# Altium schematic sheet DIO.SchDoc
size A2
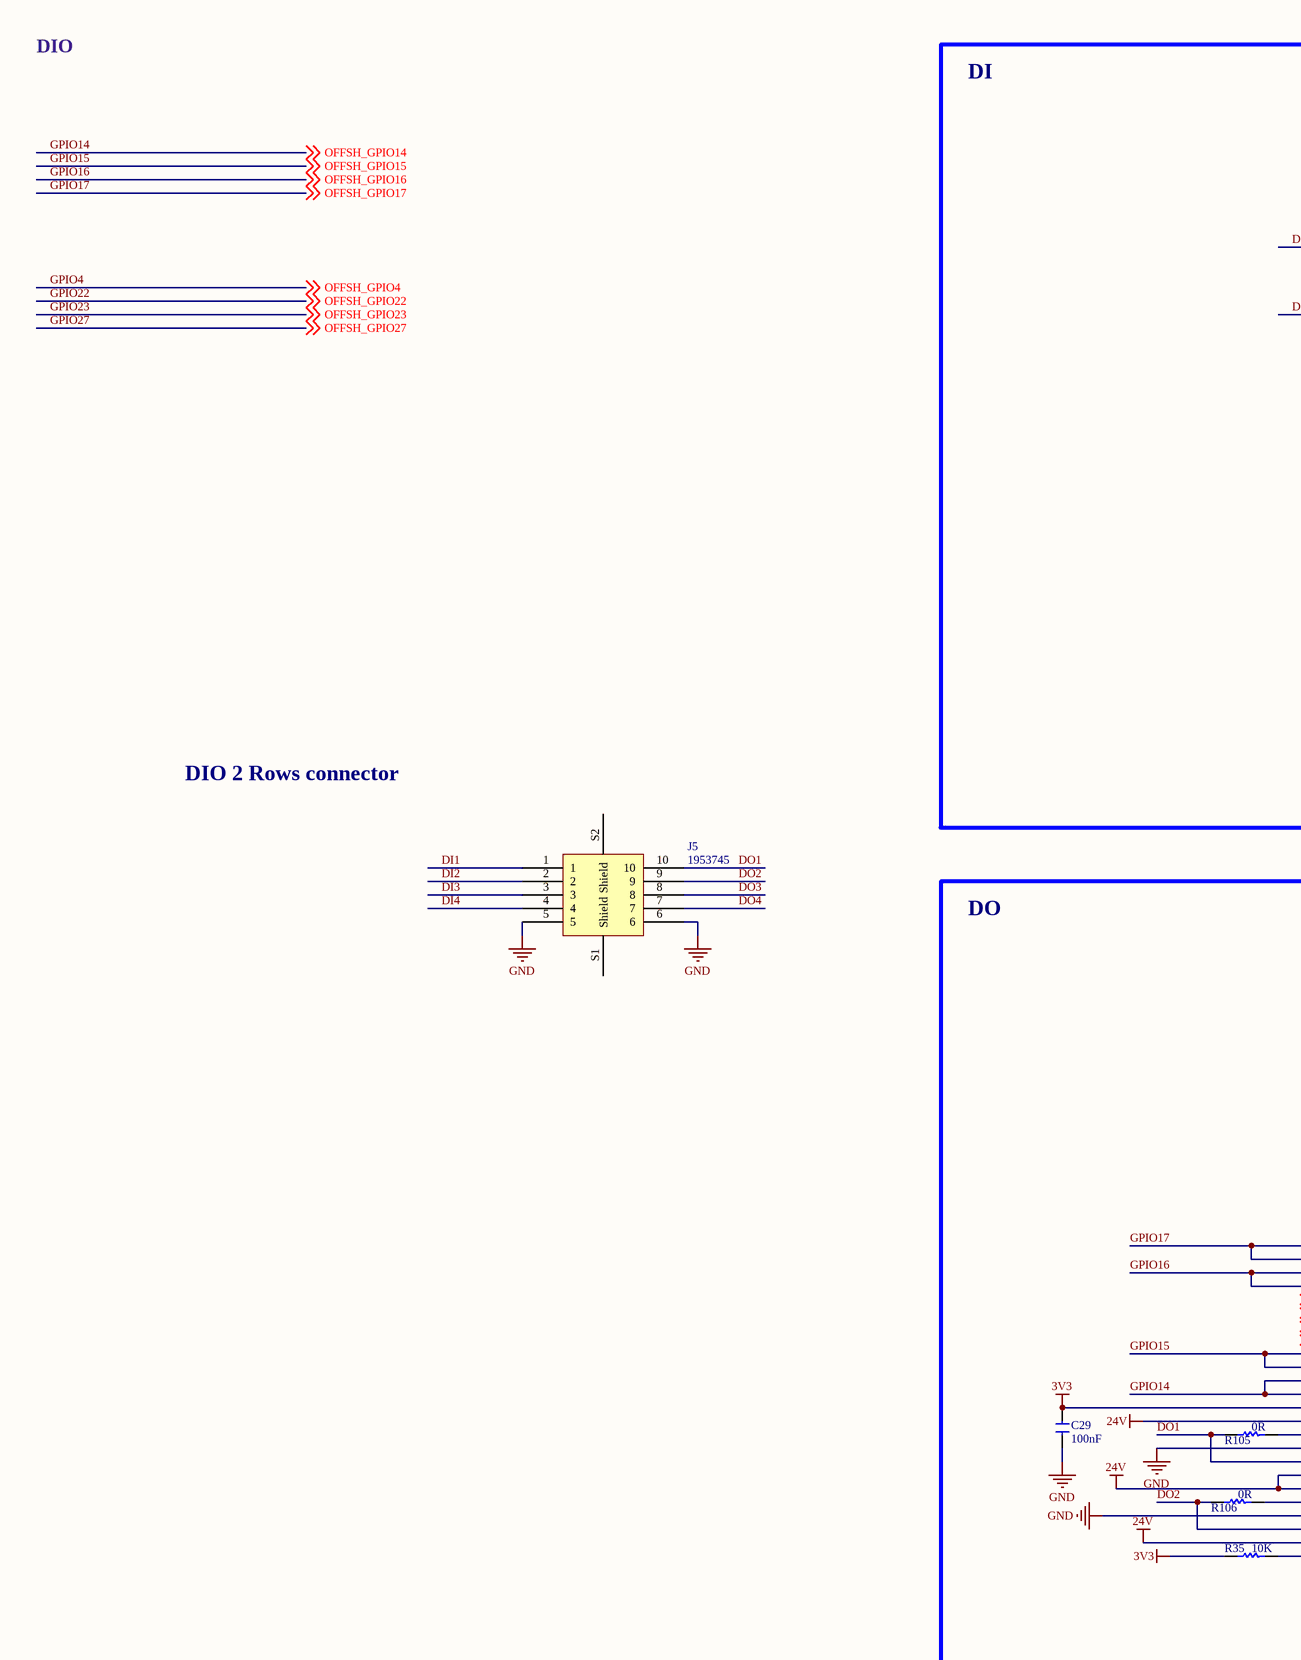
[diagram p0: DIO.SchDoc, left]
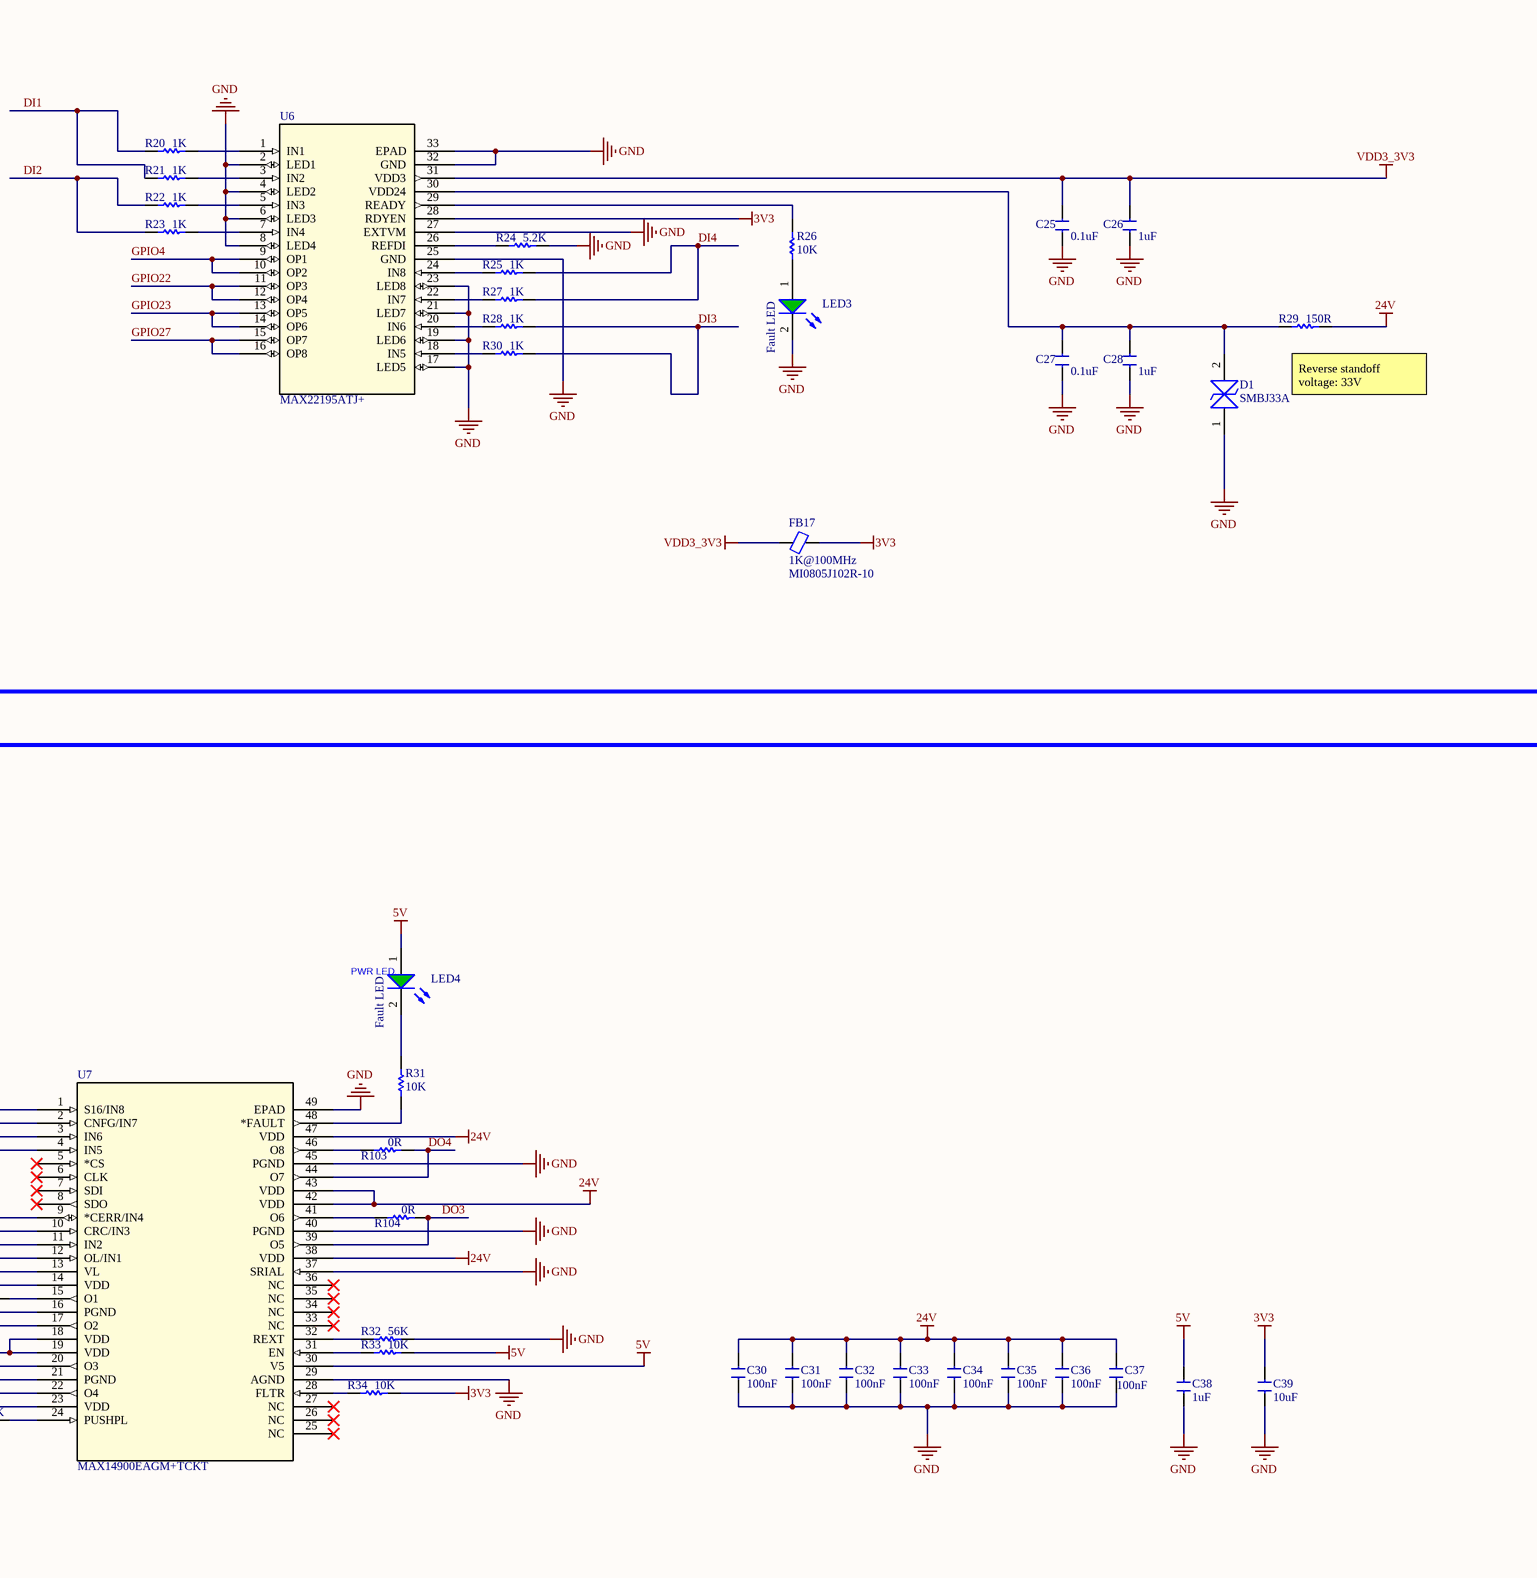
[diagram p1: DIO.SchDoc, right]

## Parts
C25  value 0.1uF  [0603 Capacitor]  (hidden comment: Ceramic Capacitor SMD)
C26  value 1uF  [0603 Capacitor]  (hidden comment: Ceramic Capacitor SMD)
C27  value 0.1uF  [0603 Capacitor]  (hidden comment: Ceramic Capacitor SMD)
C28  value 1uF  [0603 Capacitor]  (hidden comment: Ceramic Capacitor SMD)
C29  value 100nF  [0603 Capacitor]  (hidden comment: Ceramic Capacitor SMD)
C30  value 100nF  [0603 Capacitor]  (hidden comment: Ceramic Capacitor SMD)
C31  value 100nF  [0603 Capacitor]  (hidden comment: Ceramic Capacitor SMD)
C32  value 100nF  [0603 Capacitor]  (hidden comment: Ceramic Capacitor SMD)
C33  value 100nF  [0603 Capacitor]  (hidden comment: Ceramic Capacitor SMD)
C34  value 100nF  [0603 Capacitor]  (hidden comment: Ceramic Capacitor SMD)
C35  value 100nF  [0603 Capacitor]  (hidden comment: Ceramic Capacitor SMD)
C36  value 100nF  [0603 Capacitor]  (hidden comment: Ceramic Capacitor SMD)
C37  value 100nF  [0603 Capacitor]  (hidden comment: Ceramic Capacitor SMD)
C38  value 1uF  [0603 Capacitor]  (hidden comment: Ceramic Capacitor SMD)
C39  value 10uF  [0603 Capacitor]  (hidden comment: Ceramic Capacitor SMD)
D1  Part Number: SMBJ33A  [DIOM5436X244N (SMB)]  (hidden comment: TVS 8V)
FB17  value 1K@100MHz  Part Number: MI0805J102R-10  [FB0603]  (hidden comment: Ferrite Bead)
J5  1953745  [1953745]
LED3  Fault LED  [LED_0805_Green]
LED4  Fault LED  [LED_0805_Green]
R20  value 1K  [RES (0603)]  (hidden comment: Res)
R21  value 1K  [RES (0603)]  (hidden comment: Res)
R22  value 1K  [RES (0603)]  (hidden comment: Res)
R23  value 1K  [RES (0603)]  (hidden comment: Res)
R24  value 5.2K  [RES (0603)]  (hidden comment: Res)
R25  value 1K  [RES (0603)]  (hidden comment: Res)
R26  value 10K  [RES (0603)]  (hidden comment: Res)
R27  value 1K  [RES (0603)]  (hidden comment: Res)
R28  value 1K  [RES (0603)]  (hidden comment: Res)
R29  value 150R  [RES (0603)]  (hidden comment: Res)
R30  value 1K  [RES (0603)]  (hidden comment: Res)
R31  value 10K  [R0603]  (hidden comment: Res)
R32  value 56K  [RES (0603)]  (hidden comment: Res)
R33  value 10K  [RES (0603)]  (hidden comment: Res)
R34  value 10K  [RES (0603)]  (hidden comment: Res)
R35  value 10K  [RES (0603)]  (hidden comment: Res)
R103  value 0R  [RES (0603)]  (hidden comment: Res)
R104  value 0R  [RES (0603)]  (hidden comment: Res)
R105  value 0R  [RES (0603)]  (hidden comment: Res)
R106  value 0R  [RES (0603)]  (hidden comment: Res)
U6  MAX22195ATJ+  [21-0140_T3255+6C_MXM]
U7  MAX14900EAGM+TCKT  [21-100009A_K4877+1_MXM]

## Blocks framed on the sheet
DI: C25-C28 D1 FB17 LED3 R20-R30 U6
DO: C29-C39 LED4 R31-R35 R103-R106 U7

## Nets
3V3: C29.2 C39.2 FB17.2 R34.2 R35.1 U6.28(RDYEN) U7.13(VL)
5V: C38.2 LED4.1(A) R33.2 U7.30(V5)
24V: C30.2 C31.2 C32.2 C33.2 C34.2 C35.2 C36.2 C37.2 R29.2 U7.14(VDD) U7.18(VDD) U7.19(VDD) U7.23(VDD) U7.38(VDD) U7.42(VDD) U7.43(VDD) U7.47(VDD)
GND: C25.1 C26.1 C27.1 C28.1 C29.1 C30.1 C31.1 C32.1 C33.1 C34.1 C35.1 C36.1 C37.1 C38.1 C39.1 D1.1(K) J5.5 J5.6 LED3.2(C) R24.2 R32.2 U6.2(LED1) U6.4(LED2) U6.6(LED3) U6.8(LED4) U6.17(LED5) U6.19(LED6) U6.21(LED7) U6.23(LED8) U6.25(GND) U6.27(EXTVM) U6.32(GND) U6.33(EPAD) U7.16(PGND) U7.21(PGND) U7.29(AGND) U7.37(SRIAL) U7.40(PGND) U7.45(PGND) U7.49(EPAD)
VDD3_3V3: C25.2 C26.2 FB17.1 U6.31(VDD3)
DI1: J5.1 R20.1 R21.1
DI2: J5.2 R22.1 R23.1
DI3: J5.3 R28.2 R30.2
DI4: J5.4 R25.2 R27.2
DO1: J5.10 R105.1 U7.17(O2)
DO2: J5.9 R106.1 U7.22(O4)
DO3: J5.8 R104.2 U7.39(O5)
DO4: J5.7 R103.2 U7.44(O7)
GPIO4: U6.9(OP1) U6.10(OP2) ; off-sheet OFFSH_GPIO4  [also labelled OFFSH_GPIO4]
GPIO14: U7.11(IN2) U7.12(OL/IN1) ; off-sheet OFFSH_GPIO14  [also labelled OFFSH_GPIO14]
GPIO15: U7.9(*CERR/IN4) U7.10(CRC/IN3) ; off-sheet OFFSH_GPIO15  [also labelled OFFSH_GPIO15]
GPIO16: U7.3(IN6) U7.4(IN5) ; off-sheet OFFSH_GPIO16  [also labelled OFFSH_GPIO16]
GPIO17: U7.1(S16/IN8) U7.2(CNFG/IN7) ; off-sheet OFFSH_GPIO17  [also labelled OFFSH_GPIO17]
GPIO22: U6.11(OP3) U6.12(OP4) ; off-sheet OFFSH_GPIO22  [also labelled OFFSH_GPIO22]
GPIO23: U6.13(OP5) U6.14(OP6) ; off-sheet OFFSH_GPIO23  [also labelled OFFSH_GPIO23]
GPIO27: U6.15(OP7) U6.16(OP8) ; off-sheet OFFSH_GPIO27  [also labelled OFFSH_GPIO27]
NetC27_2: C27.2 C28.2 D1.2(A) R29.1 U6.30(VDD24)
NetLED3_1: LED3.1(A) R26.1
NetLED4_2: LED4.2(C) R31.1
NetR20_2: R20.2 U6.1(IN1)
NetR21_2: R21.2 U6.3(IN2)
NetR22_2: R22.2 U6.5(IN3)
NetR23_2: R23.2 U6.7(IN4)
NetR24_1: R24.1 U6.26(REFDI)
NetR25_1: R25.1 U6.24(IN8)
NetR26_2: R26.2 U6.29(READY)
NetR27_1: R27.1 U6.22(IN7)
NetR28_1: R28.1 U6.20(IN6)
NetR30_1: R30.1 U6.18(IN5)
NetR31_2: R31.2 U7.48(*FAULT)
NetR32_1: R32.1 U7.32(REXT)
NetR33_1: R33.1 U7.31(EN)
NetR34_1: R34.1 U7.28(FLTR)
NetR35_2: R35.2 U7.24(PUSHPL)
NetR103_1: R103.1 U7.46(O8)
NetR104_1: R104.1 U7.41(O6)
NetR105_2: R105.2 U7.15(O1)
NetR106_2: R106.2 U7.20(O3)

Not connected (* = marked no-connect by the designer): J5 S1(Shield) S2(Shield); U7 5(*CS)* 6(CLK)* 7(SDI)* 8(SDO)* 25(NC)* 26(NC)* 27(NC)* 33(NC)* 34(NC)* 35(NC)* 36(NC)*

## Notes on the sheet
- DIO
- (near R29) Reverse standoff voltage: 33V
- DIO 2 Rows connector
- (near LED4) PWR LED

## Library data of the parts
C25-C39 = Capacitor Ceramic SMD: Voltage: 10v; Tolerance: *%
D1 = SMBJ6.0CA: Bidirectional TVS 8V SMB; Manufacturer_Name: Littelfuse; Datasheet Link: https://www.littelfuse.com/~/media/electronics/datasheets/tvs_diodes/littelfuse_tvs_diode_smbj_datasheet.pdf.pdf; Height: 2.44mm; Link: https://www.digikey.sg/product-detail/en/littelfuse-inc/SMBJ6.0CA/SMBJ6.0CALFCT-ND/286102
FB17 = Ferrite Bead: Ferrite Bead SMD; Link: https://www.digikey.com/product-detail/en/laird-signal-integrity-products/MI0805J102R-10/240-2551-1-ND/1015989
LED3 LED4 = WL-SMCW 0805  150080GS75000: SMD mono-color Chip LED, WL-SMCW, Green; Manufacturer: W黵th Elektronik eiSos GmbH; PartNo: 150080GS75000; ComponentLink1Description: Manufacturer; ComponentLink1URL: http://www.we-online.de; Created by: Christin Otto; Created Date: June 2013; ComponentLink2Description: Datasheet; ComponentLink2URL: http://katalog.we-online.com/led/datasheet/150080GS75000.pdf; Color: Green
R20-R30 R32-R35 R103-R106 = Res: SMD resistor; Tolerance: 5%
R31 = Res: Resistor; Published: 8-Jun-2000; LatestRevisionDate: 17-Jul-2002; LatestRevisionNote: Re-released for DXP Platform.; PackageReference: AXIAL-0.3; Publisher: Altium Limited
U6 = MAX22195ATJ+: Parallel Digital Input; Built_By: EMA_UL_Team; Vendor: Maxim Integrated Products; SourceLibrary: Update_to_database_2021-06-01; Copyright: Copyright (C) 2018 Accelerated Designs. All rights reserved; Manufacturer_Part_Number: MAX22195ATJ+; Revision: 4; RefDes: RefDes; Type: DEV
U7 = MAX14900EAGM+TCKT: No Description Available; Vendor: Maxim Integrated Products; Built_By: EMA_UL_Team; SourceLibrary: Maxim_2017-04-18; Manufacturer_Part_Number: MAX14900EAGM+TCKT; Copyright: Copyright (C) 2018 Accelerated Designs. All rights reserved; Revision: 2; RefDes: RefDes; Type: DEV